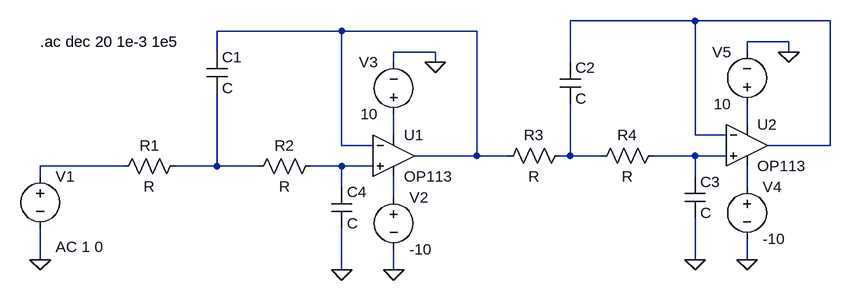
[diagram p0: schematic Draft1.asc]
Draft1.asc, the LTspice schematic file:
Version 4
SHEET 1 1268 680
WIRE 960 -112 768 -112
WIRE 1168 -112 960 -112
WIRE 416 -96 224 -96
WIRE 624 -96 416 -96
WIRE 1104 -80 1040 -80
WIRE 224 -64 224 -96
WIRE 560 -64 496 -64
WIRE 1040 -64 1040 -80
WIRE 1104 -64 1104 -80
WIRE 496 -48 496 -64
WIRE 560 -48 560 -64
WIRE 768 -48 768 -112
WIRE 1040 48 1040 16
WIRE 496 64 496 32
WIRE 960 64 960 -112
WIRE 1008 64 960 64
WIRE 416 80 416 -96
WIRE 464 80 416 80
WIRE 1168 80 1168 -112
WIRE 1168 80 1072 80
WIRE 624 96 624 -96
WIRE 624 96 528 96
WIRE 672 96 624 96
WIRE 768 96 768 16
WIRE 768 96 752 96
WIRE 816 96 768 96
WIRE 960 96 896 96
WIRE 1008 96 960 96
WIRE 80 112 -48 112
WIRE 224 112 224 0
WIRE 224 112 160 112
WIRE 288 112 224 112
WIRE 416 112 368 112
WIRE 464 112 416 112
WIRE -48 128 -48 112
WIRE 960 128 960 96
WIRE 416 144 416 112
WIRE 1040 144 1040 112
WIRE 496 160 496 128
WIRE -48 256 -48 208
WIRE 960 256 960 192
WIRE 1040 256 1040 224
WIRE 416 272 416 208
WIRE 496 272 496 240
FLAG -48 256 0
FLAG 496 272 0
FLAG 560 -48 0
FLAG 416 272 0
FLAG 1040 256 0
FLAG 1104 -64 0
FLAG 960 256 0
SYMBOL voltage -48 112 R0
WINDOW 123 24 124 Left 2
WINDOW 39 0 0 Left 0
SYMATTR Value2 AC 1 0
SYMATTR InstName V1
SYMATTR Value ""
SYMBOL OpAmps\\OP113 496 32 R0
SYMATTR InstName U1
SYMBOL voltage 496 144 R0
WINDOW 123 0 0 Left 0
WINDOW 39 0 0 Left 0
SYMATTR InstName V2
SYMATTR Value -10
SYMBOL voltage 496 48 R180
WINDOW 0 24 96 Left 2
WINDOW 3 24 16 Left 2
WINDOW 123 0 0 Left 0
WINDOW 39 0 0 Left 0
SYMATTR InstName V3
SYMATTR Value 10
SYMBOL OpAmps\\OP113 1040 16 R0
SYMATTR InstName U2
SYMBOL voltage 1040 128 R0
WINDOW 123 0 0 Left 0
WINDOW 39 0 0 Left 0
SYMATTR InstName V4
SYMATTR Value -10
SYMBOL voltage 1040 32 R180
WINDOW 0 24 96 Left 2
WINDOW 3 24 16 Left 2
WINDOW 123 0 0 Left 0
WINDOW 39 0 0 Left 0
SYMATTR InstName V5
SYMATTR Value 10
SYMBOL res 176 96 R90
WINDOW 0 0 56 VBottom 2
WINDOW 3 32 56 VTop 2
SYMATTR InstName R1
SYMBOL res 384 96 R90
WINDOW 0 0 56 VBottom 2
WINDOW 3 32 56 VTop 2
SYMATTR InstName R2
SYMBOL res 768 80 R90
WINDOW 0 0 56 VBottom 2
WINDOW 3 32 56 VTop 2
SYMATTR InstName R3
SYMBOL res 912 80 R90
WINDOW 0 0 56 VBottom 2
WINDOW 3 32 56 VTop 2
SYMATTR InstName R4
SYMBOL cap 208 -64 R0
SYMATTR InstName C1
SYMBOL cap 752 -48 R0
SYMATTR InstName C2
SYMBOL cap 944 128 R0
SYMATTR InstName C3
SYMBOL cap 400 144 R0
SYMATTR InstName C4
TEXT -48 -80 Left 2 !.ac dec 20 1e-3 1e5

The netlist it stands for:
* Draft1.asc
V1 N007 0 AC 1 0
XU1 N009 N002 N004 N011 N002 OP113  ; pins In+ In- V+ V- OUT
V2 N011 0 -10
V3 N004 0 10
XU2 N006 N001 N003 N010 N001 OP113  ; pins In+ In- V+ V- OUT
V4 N010 0 -10
V5 N003 0 10
R1 N008 N007 R
R2 N009 N008 R
R3 N005 N002 R
R4 N006 N005 R
C1 N002 N008 C
C2 N001 N005 C
C3 N006 0 C
C4 N009 0 C
.ac dec 20 1e-3 1e5
.lib ADI.lib
.backanno
.end